# Altium schematic sheet USB_connnection.SchDoc
size 209 x 297 mm
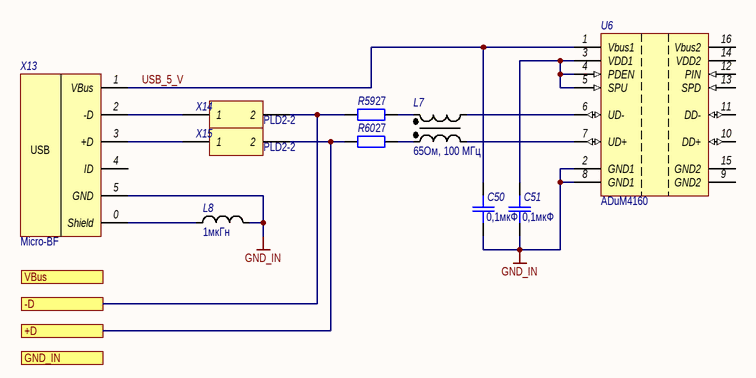
[diagram p0: USB_connnection.SchDoc]

## Parts
C50  0,1мкФ  [SMD_0805]
C51  0,1мкФ  [SMD_0805]
L7  65Ом, 100 МГц  [ACM2012]
L8  1мкГн  [SMD_0805]
R59  27  [SMD_0805]
R60  27  [SMD_0805]
U6  ADuM1402  [SOIC-16-WIDE]  (value not drawn)
X13  Наименование: Micro-BF  [USB Micro-BF]  (hidden comment: mico-BF)
X14  Наименование: PLD2-2  [PLD2-20]  (hidden comment: Header 2X1)
X15  Наименование: PLD2-2  [PLD2-20]  (hidden comment: Header 2X1)

## Ports
+D, -D, GND_IN, VBus

## Nets
GND_IN: C50.1 C51.1 L8.2 U6.2(GND1) U6.8(GND1) X13.5(GND)
+D: R60.1 X15.2 ; port +D
-D: R59.1 X14.2 ; port -D
USB_5_V: C50.2 U6.1(Vbus1) X13.1(VBus)
NetC51_2: C51.2 U6.3(VDD1) U6.4(PDEN) U6.5(SPU)
NetL7_1: L7.1 U6.7(UD+)
NetL7_2: L7.2 R60.2
NetL7_3: L7.3 R59.2
NetL7_4: L7.4 U6.6(UD-)
NetL8_1: L8.1 X13.0(Shield)
NetX13_2: X13.2(-D) X14.1
NetX13_3: X13.3(+D) X15.1

Not connected (* = marked no-connect by the designer): U6 9(GND2) 10(DD+) 11(DD-) 12(PIN) 13(SPD) 14(VDD2) 15(GND2) 16(Vbus2); X13 4(ID)

## Notes on the sheet
- Подп. и дата
- Инв. № дубл.
- Взам. инв. №
- Инв. № подл.
- Изм.
- Лист
- № докум.
- Подп.
- Дата
- Форма 2а ГОСТ 2.104-2006
- Копировал
- Формат А4
- (in symbol MicroUSB) USB

## Library data of the parts
C50 C51 = Capacitor: Назначение: SMD-конденсатор; Наименование: Конденсатор; Потребление, Вт: 0; Value: 0,1мкФ
L7 = Inductor_coupled: Coupled inductor; Назначение: Связанная индуктивность; Value: 20мкГн, 8,5мОм; Наименование: PLT10HH1026R0PN; Потребление, Вт: 0,1
L8 = Inductor: Наименование: Индуктивность; Назначение: SMD-индуктивность; Потребление, Вт: 0,010; Value: 1мкГн
R59 R60 = Resistor: Наименование: Резистор; Назначение: SMD-резистор; Потребление, Вт: 0,001; Value: 1к
U6 = ADuM4160: Quad Channel Digital Isolator, 2.5 KV rms Insulation Rating; Назначение: цифровой изолятор шины USB; Потребление, Вт: 0,025; DataSheet: https://www.analog.com/media/en/technical-documentation/data-sheets/ADuM4160.pdf; Наименование: ADuM4160
X13 = MicroUSB: USB mico-BF; Назначение: Разъем на плату; Потребление, Вт: 0; DataSheet: *
X14 X15 = HDR2X1: Header, 12-Pin, Dual row; Назначение: Header, 20-Pin, Dual row; Потребление, Вт: 0,0